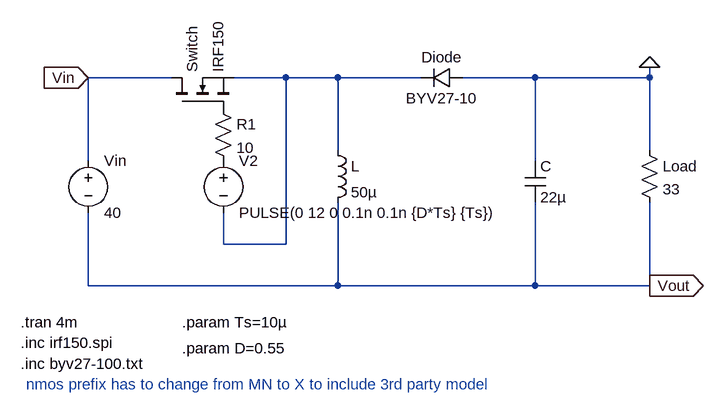
[diagram p0: schematic buck-boost_converter.asc]
buck-boost_converter.asc, the LTspice schematic file:
Version 4
SHEET 1 1508 680
WIRE 224 32 96 32
WIRE 400 32 320 32
WIRE 480 32 400 32
WIRE 608 32 480 32
WIRE 784 32 672 32
WIRE 960 32 960 16
WIRE 960 32 784 32
WIRE 480 144 480 32
WIRE 960 144 960 32
WIRE 96 160 96 32
WIRE 784 160 784 32
WIRE 304 288 304 240
WIRE 400 288 400 32
WIRE 400 288 304 288
WIRE 96 352 96 240
WIRE 480 352 480 224
WIRE 480 352 96 352
WIRE 784 352 784 224
WIRE 784 352 480 352
WIRE 960 352 960 224
WIRE 960 352 784 352
FLAG 960 16 0
FLAG 96 32 Vin
IOPIN 96 32 In
FLAG 960 352 Vout
IOPIN 960 352 Out
SYMBOL voltage 96 144 R0
WINDOW 123 0 0 Left 0
WINDOW 39 0 0 Left 0
SYMATTR InstName Vin
SYMATTR Value 40
SYMBOL nmos 224 80 R270
SYMATTR InstName Switch
SYMATTR Value IRF150
SYMATTR Prefix X
SYMBOL ind 464 128 R0
SYMATTR InstName L
SYMATTR Value 50µ
SYMBOL cap 768 160 R0
SYMATTR InstName C
SYMATTR Value 22µ
SYMBOL res 288 64 R0
SYMATTR InstName R1
SYMATTR Value 10
SYMBOL res 944 128 R0
SYMATTR InstName Load
SYMATTR Value 33
SYMBOL diode 672 16 R90
WINDOW 0 0 32 VBottom 2
WINDOW 3 32 32 VTop 2
SYMATTR InstName Diode
SYMATTR Value BYV27-10
SYMBOL voltage 304 144 R0
WINDOW 123 0 0 Left 0
WINDOW 39 0 0 Left 0
SYMATTR InstName V2
SYMATTR Value PULSE(0 12 0 0.1n 0.1n {D*Ts} {Ts})
TEXT -8 440 Left 2 !.inc irf150.spi
TEXT -8 408 Left 2 !.tran 4m
TEXT 0 504 Left 2 ;nmos prefix has to change from MN to X to include 3rd party model
TEXT -8 472 Left 2 !.inc byv27-100.txt
TEXT 240 408 Left 2 !.param Ts=10µ
TEXT 240 448 Left 2 !.param D=0.55

The netlist it stands for:
* buck-boost_converter.asc
Vin Vin Vout 40
XSwitch Vin P001 N001 IRF150  ; pins D G S
L N001 Vout 50µ
C 0 Vout 22µ
R1 P001 P002 10
R§Load 0 Vout 33
Diode 0 N001 BYV27-10
V2 P002 N001 PULSE(0 12 0 0.1n 0.1n {D*Ts} {Ts})
.model D D
.lib standard.dio
.inc irf150.spi
.tran 4m
* nmos prefix has to change from MN to X to include 3rd party model
.inc byv27-100.txt
.param Ts=10µ
.param D=0.55
.backanno
.end